# Altium schematic sheet connectors.SchDoc
size A; SheetNumber: 5; SheetTotal: 5
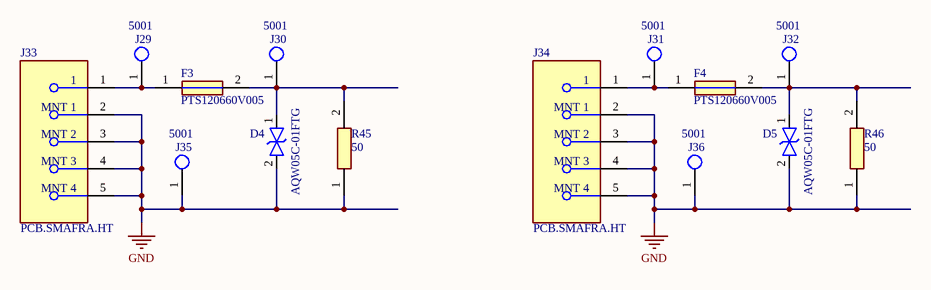
[diagram p0: connectors.SchDoc]

## Parts
D4  AQW05C-01FTG  [SOD2613X100N]
D5  AQW05C-01FTG  [SOD2613X100N]
F3  PTS120660V005  [FUSC3216X90N]
F4  PTS120660V005  [FUSC3216X90N]
J29  5001  [FP-5001-MFG]
J30  5001  [FP-5001-MFG]
J31  5001  [FP-5001-MFG]
J32  5001  [FP-5001-MFG]
J33  PCB.SMAFRA.HT  [FP-PCB_SMAFRA_HT-MFG]
J34  PCB.SMAFRA.HT  [FP-PCB_SMAFRA_HT-MFG]
J35  5001  [FP-5001-MFG]
J36  5001  [FP-5001-MFG]
R45  50  [RESC6332X65N]
R46  50  [RESC6332X65N]

## Nets
GND: D4.2 D5.2 J33.2(MNT_1) J33.3(MNT_2) J33.4(MNT_3) J33.5(MNT_4) J34.2(MNT_1) J34.3(MNT_2) J34.4(MNT_3) J34.5(MNT_4) J35.1 J36.1 R45.1 R46.1
NetD4_1: D4.1 F3.2 J30.1 R45.2
NetD5_1: D5.1 F4.2 J32.1 R46.2
NetF3_1: F3.1 J29.1 J33.1
NetF4_1: F4.1 J31.1 J34.1

## Library data of the parts
D4 D5 = AQW05C-01FTG: TVS Diode (Bi-directional); Manufacturer_Name: LITTELFUSE; Datasheet Link: https://www.littelfuse.com/media?resourcetype=datasheets&itemid=80ae0bbb-a157-46a1-97eb-84c82c82e9e5&filename=littelfuse-tvs-diode-array-aqw05c-01ftg-datasheet; Height: 1mm; Manufacturer_Part_Number: AQW05C-01FTG; Mouser Part Number: 576-AQW05C-01FTG; Mouser Price/Stock: https://www.mouser.co.uk/ProductDetail/Littelfuse/AQW05C-01FTG?qs=Z%252BL2brAPG1JHH8XKoKQPyw%3D%3D
F3 F4 = PTS120660V005: Fuse; Manufacturer_Name: Eaton; Datasheet Link: https://in.element14.com/eaton-bussmann-series/pts120660v005/pptc-resettable-fuse-0-05a-60vdc/dp/2929344?srsltid=AfmBOorX1B25_1GKuczfUlW7ilxwoZgl3KmxHJmMFzJpoWYAJ50DmC3S; Height: 0.9mm; Manufacturer_Part_Number: PTS120660V005; Mouser Part Number: 504-PTS120660V005; Mouser Price/Stock: https://www.mouser.co.uk/ProductDetail/Eaton-Electronics/PTS120660V005?qs=QmibqUXyDhQPirhmCJ6OpQ%3D%3D; Arrow Part Number: PTS120660V005; Arrow Price/Stock: https://www.arrow.com/en/products/pts120660v005/eaton?region=europe
J29-J32 J35 J36 = CMP-2000-05181-2: PC TEST POINT MINIATURE BLACK; Body Material: Bronze; Plating: Silver; Inside Diameter: 1.27mm; Hole Diameter: 1.6mm; Number of Ports: 1; Outside Diameter: 2.54mm; Insulation: Insulated; Insulation Material: Nylon; Mount: Through Hole; RoHS Compliant: Yes; Series: THM; Height: 0.3inch; Termination: Through Hole; Material: Nylon; Packaging: Bulk; Contact Material: Bronze; REACH SVHC: No SVHC; Contact Plating: Silver; Orientation: Straight; Lead Free: Lead Free; Package Quantity: 100; Length: 7.62mm; Flammability Rating: UL94 V-0; Number of Contacts: 1; Diameter: 2.54mm; Housing Color: Black; Color: Black
J33 J34 = CMP-111093-000003-1: CONN SMA JACK R/A 50OHM PCB; Dielectric Material: PTFE; Max Frequency: 6GHz; Body Material: Brass; Center Contact Plating: Gold; Voltage Rating: 500V; Operating Frequency: 0 to 6 GHz; Number of Ports: 1; Impedance: 50R; Housing Color: Gold; Mount: Through Hole; Orientation: Right Angle; Termination: Solder; Contact Material: Brass; Series: -; Contact Plating: Gold; Fastening Type: Threaded; Connector Type: SMA; Package Quantity: 500; Case/Package: SMA; Body Plating: Gold; Frequency: 6GHz; Packaging: Tray
R45 R46 = RNCL2512FT50R0: Resistor; Manufacturer_Name: Stackpole Electronics; Datasheet Link: https://www.seielect.com/catalog/sei-rncl.pdf; Height: 0.65mm; Manufacturer_Part_Number: RNCL2512FT50R0; Resistance: 50